# Altium schematic sheet LED.schdoc
size 703 x 248 mm
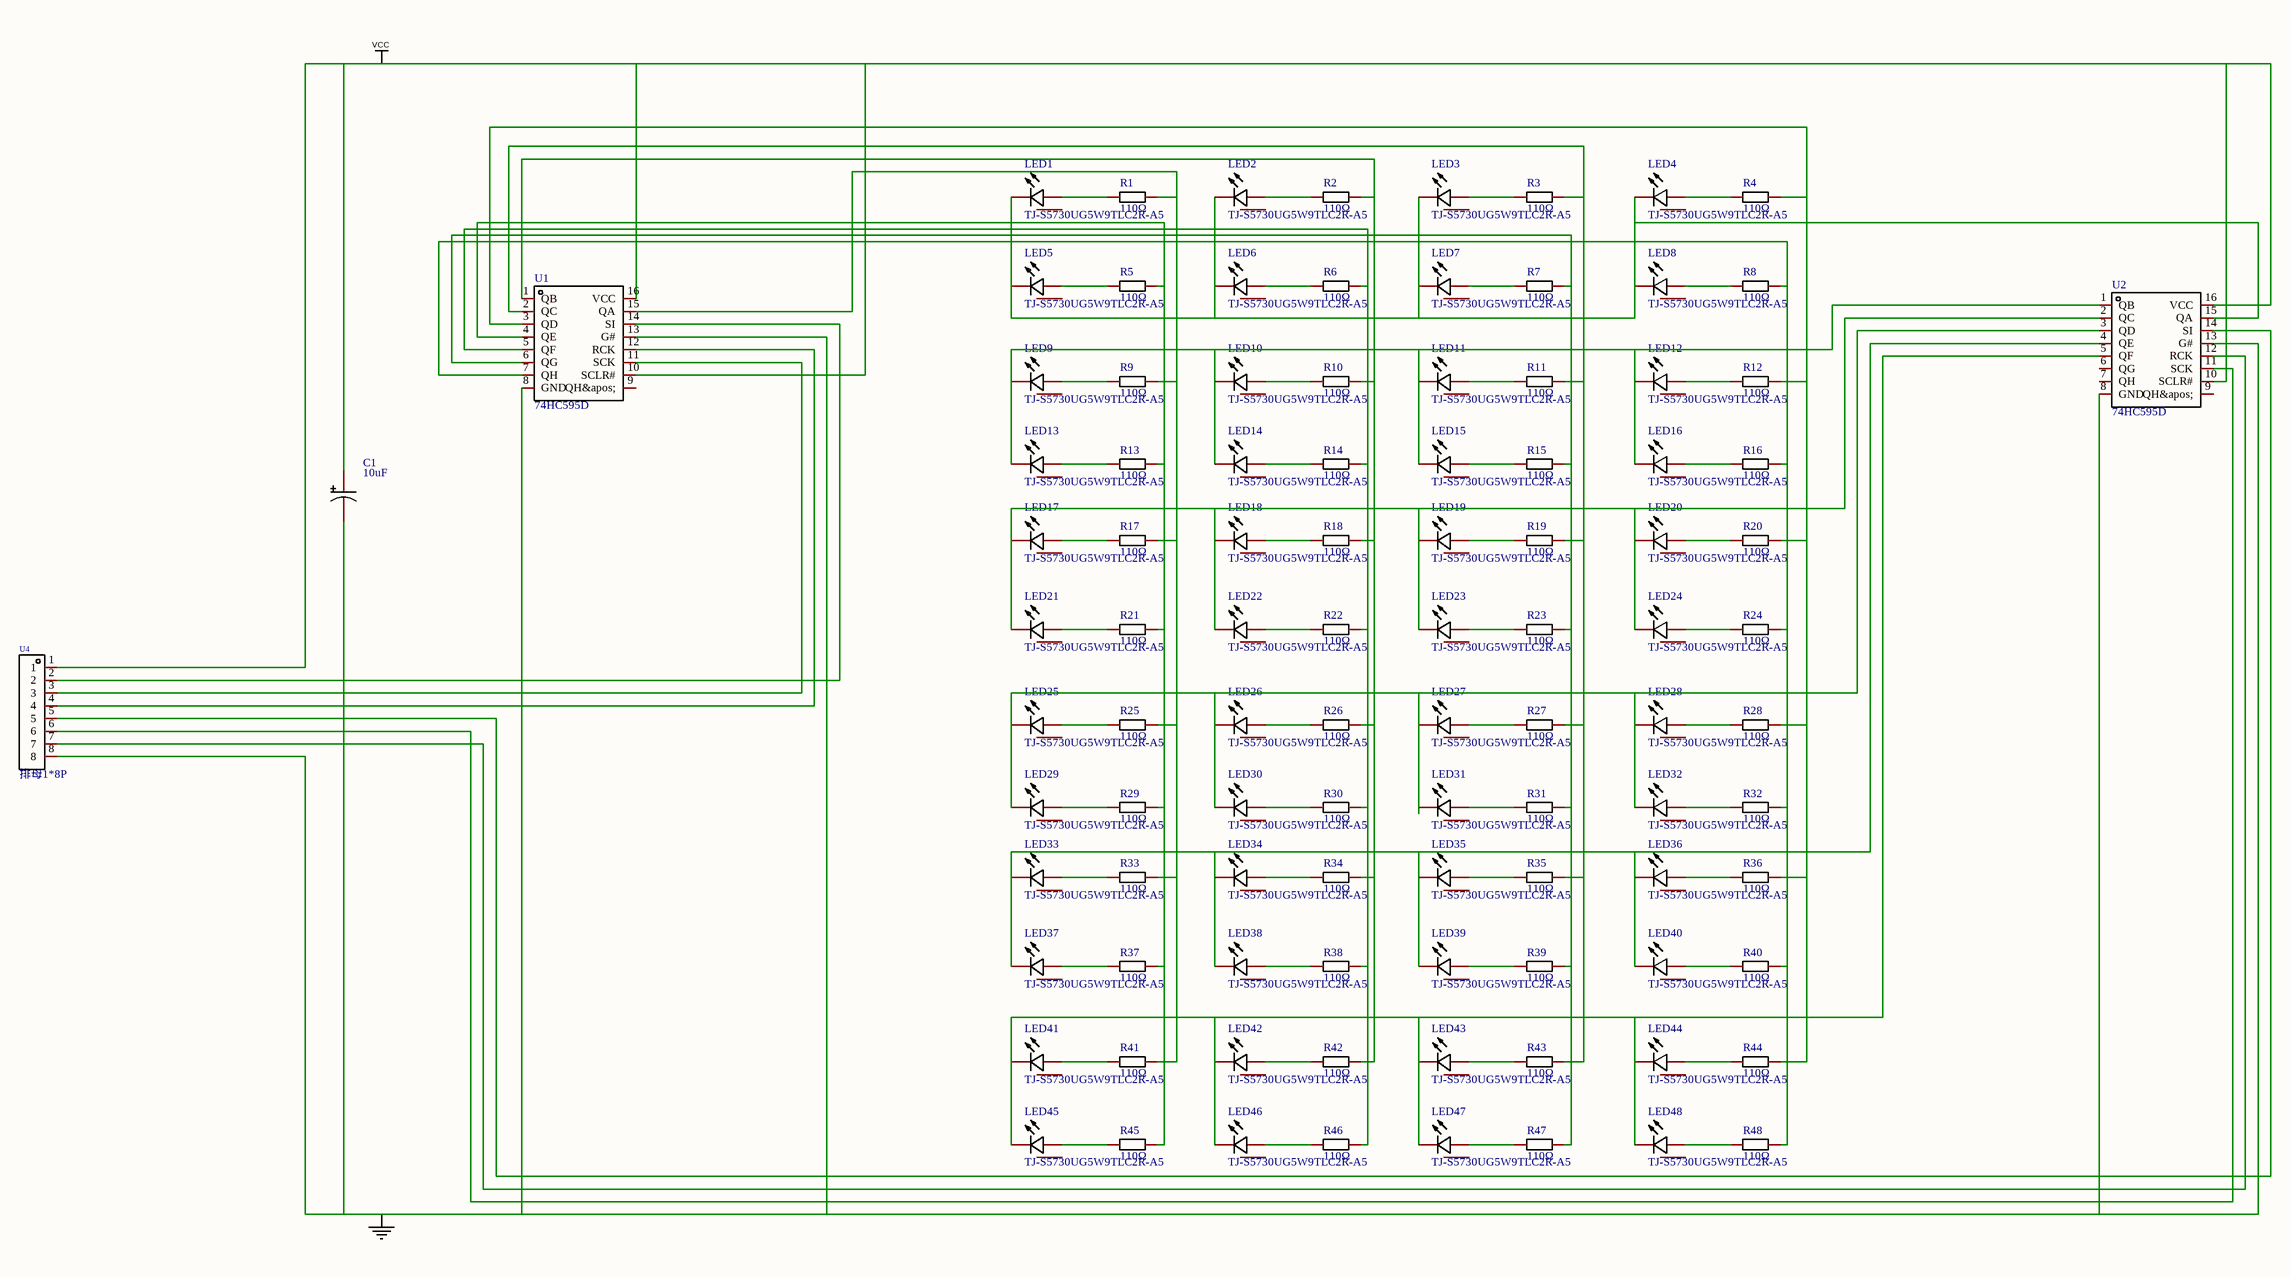
[diagram p0: LED.schdoc]

## Parts
C1  10uF  [CAP-SMD_BD5.0-L5.3-W5.3-LS6.0-FD]
LED1  TJ-S5730UG5W9TLC2R-A5  [LED-SMD_L5.7-W3.0-R-RD]
LED2  TJ-S5730UG5W9TLC2R-A5  [LED-SMD_L5.7-W3.0-R-RD]
LED3  TJ-S5730UG5W9TLC2R-A5  [LED-SMD_L5.7-W3.0-R-RD]
LED4  TJ-S5730UG5W9TLC2R-A5  [LED-SMD_L5.7-W3.0-R-RD]
LED5  TJ-S5730UG5W9TLC2R-A5  [LED-SMD_L5.7-W3.0-R-RD]
LED6  TJ-S5730UG5W9TLC2R-A5  [LED-SMD_L5.7-W3.0-R-RD]
LED7  TJ-S5730UG5W9TLC2R-A5  [LED-SMD_L5.7-W3.0-R-RD]
LED8  TJ-S5730UG5W9TLC2R-A5  [LED-SMD_L5.7-W3.0-R-RD]
LED9  TJ-S5730UG5W9TLC2R-A5  [LED-SMD_L5.7-W3.0-R-RD]
LED10  TJ-S5730UG5W9TLC2R-A5  [LED-SMD_L5.7-W3.0-R-RD]
LED11  TJ-S5730UG5W9TLC2R-A5  [LED-SMD_L5.7-W3.0-R-RD]
LED12  TJ-S5730UG5W9TLC2R-A5  [LED-SMD_L5.7-W3.0-R-RD]
LED13  TJ-S5730UG5W9TLC2R-A5  [LED-SMD_L5.7-W3.0-R-RD]
LED14  TJ-S5730UG5W9TLC2R-A5  [LED-SMD_L5.7-W3.0-R-RD]
LED15  TJ-S5730UG5W9TLC2R-A5  [LED-SMD_L5.7-W3.0-R-RD]
LED16  TJ-S5730UG5W9TLC2R-A5  [LED-SMD_L5.7-W3.0-R-RD]
LED17  TJ-S5730UG5W9TLC2R-A5  [LED-SMD_L5.7-W3.0-R-RD]
LED18  TJ-S5730UG5W9TLC2R-A5  [LED-SMD_L5.7-W3.0-R-RD]
LED19  TJ-S5730UG5W9TLC2R-A5  [LED-SMD_L5.7-W3.0-R-RD]
LED20  TJ-S5730UG5W9TLC2R-A5  [LED-SMD_L5.7-W3.0-R-RD]
LED21  TJ-S5730UG5W9TLC2R-A5  [LED-SMD_L5.7-W3.0-R-RD]
LED22  TJ-S5730UG5W9TLC2R-A5  [LED-SMD_L5.7-W3.0-R-RD]
LED23  TJ-S5730UG5W9TLC2R-A5  [LED-SMD_L5.7-W3.0-R-RD]
LED24  TJ-S5730UG5W9TLC2R-A5  [LED-SMD_L5.7-W3.0-R-RD]
LED25  TJ-S5730UG5W9TLC2R-A5  [LED-SMD_L5.7-W3.0-R-RD]
LED26  TJ-S5730UG5W9TLC2R-A5  [LED-SMD_L5.7-W3.0-R-RD]
LED27  TJ-S5730UG5W9TLC2R-A5  [LED-SMD_L5.7-W3.0-R-RD]
LED28  TJ-S5730UG5W9TLC2R-A5  [LED-SMD_L5.7-W3.0-R-RD]
LED29  TJ-S5730UG5W9TLC2R-A5  [LED-SMD_L5.7-W3.0-R-RD]
LED30  TJ-S5730UG5W9TLC2R-A5  [LED-SMD_L5.7-W3.0-R-RD]
LED31  TJ-S5730UG5W9TLC2R-A5  [LED-SMD_L5.7-W3.0-R-RD]
LED32  TJ-S5730UG5W9TLC2R-A5  [LED-SMD_L5.7-W3.0-R-RD]
LED33  TJ-S5730UG5W9TLC2R-A5  [LED-SMD_L5.7-W3.0-R-RD]
LED34  TJ-S5730UG5W9TLC2R-A5  [LED-SMD_L5.7-W3.0-R-RD]
LED35  TJ-S5730UG5W9TLC2R-A5  [LED-SMD_L5.7-W3.0-R-RD]
LED36  TJ-S5730UG5W9TLC2R-A5  [LED-SMD_L5.7-W3.0-R-RD]
LED37  TJ-S5730UG5W9TLC2R-A5  [LED-SMD_L5.7-W3.0-R-RD]
LED38  TJ-S5730UG5W9TLC2R-A5  [LED-SMD_L5.7-W3.0-R-RD]
LED39  TJ-S5730UG5W9TLC2R-A5  [LED-SMD_L5.7-W3.0-R-RD]
LED40  TJ-S5730UG5W9TLC2R-A5  [LED-SMD_L5.7-W3.0-R-RD]
LED41  TJ-S5730UG5W9TLC2R-A5  [LED-SMD_L5.7-W3.0-R-RD]
LED42  TJ-S5730UG5W9TLC2R-A5  [LED-SMD_L5.7-W3.0-R-RD]
LED43  TJ-S5730UG5W9TLC2R-A5  [LED-SMD_L5.7-W3.0-R-RD]
LED44  TJ-S5730UG5W9TLC2R-A5  [LED-SMD_L5.7-W3.0-R-RD]
LED45  TJ-S5730UG5W9TLC2R-A5  [LED-SMD_L5.7-W3.0-R-RD]
LED46  TJ-S5730UG5W9TLC2R-A5  [LED-SMD_L5.7-W3.0-R-RD]
LED47  TJ-S5730UG5W9TLC2R-A5  [LED-SMD_L5.7-W3.0-R-RD]
LED48  TJ-S5730UG5W9TLC2R-A5  [LED-SMD_L5.7-W3.0-R-RD]
R1  110Ω  [R0603]
R2  110Ω  [R0603]
R3  110Ω  [R0603]
R4  110Ω  [R0603]
R5  110Ω  [R0603]
R6  110Ω  [R0603]
R7  110Ω  [R0603]
R8  110Ω  [R0603]
R9  110Ω  [R0603]
R10  110Ω  [R0603]
R11  110Ω  [R0603]
R12  110Ω  [R0603]
R13  110Ω  [R0603]
R14  110Ω  [R0603]
R15  110Ω  [R0603]
R16  110Ω  [R0603]
R17  110Ω  [R0603]
R18  110Ω  [R0603]
R19  110Ω  [R0603]
R20  110Ω  [R0603]
R21  110Ω  [R0603]
R22  110Ω  [R0603]
R23  110Ω  [R0603]
R24  110Ω  [R0603]
R25  110Ω  [R0603]
R26  110Ω  [R0603]
R27  110Ω  [R0603]
R28  110Ω  [R0603]
R29  110Ω  [R0603]
R30  110Ω  [R0603]
R31  110Ω  [R0603]
R32  110Ω  [R0603]
R33  110Ω  [R0603]
R34  110Ω  [R0603]
R35  110Ω  [R0603]
R36  110Ω  [R0603]
R37  110Ω  [R0603]
R38  110Ω  [R0603]
R39  110Ω  [R0603]
R40  110Ω  [R0603]
R41  110Ω  [R0603]
R42  110Ω  [R0603]
R43  110Ω  [R0603]
R44  110Ω  [R0603]
R45  110Ω  [R0603]
R46  110Ω  [R0603]
R47  110Ω  [R0603]
R48  110Ω  [R0603]
U1  74HC595D  [SOIC-16_L9.9-W3.9-P1.27-LS6.0-BL]
U2  74HC595D  [SOIC-16_L9.9-W3.9-P1.27-LS6.0-BL]
U4  排母1*8P  [HDR-TH_8P-P1.27-V-F]

## Nets
NetC1_2: C1.2 U1.8(GND) U1.13(G#) U2.8(GND) U2.13(G#) U4.8
VCC: C1.1 U1.10(SCLR#) U1.16(VCC) U2.10(SCLR#) U2.16(VCC) U4.1
NetLED1_1: LED1.1(+) R1.1
NetLED1_2: LED1.2(-) LED2.2(-) LED3.2(-) LED4.2(-) LED5.2(-) LED6.2(-) LED7.2(-) LED8.2(-) U2.15(QA)
NetLED2_1: LED2.1(+) R2.1
NetLED3_1: LED3.1(+) R3.1
NetLED4_1: LED4.1(+) R4.1
NetLED5_1: LED5.1(+) R5.1
NetLED6_1: LED6.1(+) R6.1
NetLED7_1: LED7.1(+) R7.1
NetLED8_1: LED8.1(+) R8.1
NetLED9_1: LED9.1(+) R9.1
NetLED9_2: LED9.2(-) LED10.2(-) LED11.2(-) LED12.2(-) LED13.2(-) LED14.2(-) LED15.2(-) LED16.2(-) U2.1(QB)
NetLED10_1: LED10.1(+) R10.1
NetLED11_1: LED11.1(+) R11.1
NetLED12_1: LED12.1(+) R12.1
NetLED13_1: LED13.1(+) R13.1
NetLED14_1: LED14.1(+) R14.1
NetLED15_1: LED15.1(+) R15.1
NetLED16_1: LED16.1(+) R16.1
NetLED17_1: LED17.1(+) R17.1
NetLED17_2: LED17.2(-) LED18.2(-) LED19.2(-) LED20.2(-) LED21.2(-) LED22.2(-) LED23.2(-) LED24.2(-) U2.2(QC)
NetLED18_1: LED18.1(+) R18.1
NetLED19_1: LED19.1(+) R19.1
NetLED20_1: LED20.1(+) R20.1
NetLED21_1: LED21.1(+) R21.1
NetLED22_1: LED22.1(+) R22.1
NetLED23_1: LED23.1(+) R23.1
NetLED24_1: LED24.1(+) R24.1
NetLED25_1: LED25.1(+) R25.1
NetLED25_2: LED25.2(-) LED26.2(-) LED27.2(-) LED28.2(-) LED29.2(-) LED30.2(-) LED31.2(-) LED32.2(-) U2.3(QD)
NetLED26_1: LED26.1(+) R26.1
NetLED27_1: LED27.1(+) R27.1
NetLED28_1: LED28.1(+) R28.1
NetLED29_1: LED29.1(+) R29.1
NetLED30_1: LED30.1(+) R30.1
NetLED31_1: LED31.1(+) R31.1
NetLED32_1: LED32.1(+) R32.1
NetLED33_1: LED33.1(+) R33.1
NetLED33_2: LED33.2(-) LED34.2(-) LED35.2(-) LED36.2(-) LED37.2(-) LED38.2(-) LED39.2(-) LED40.2(-) U2.4(QE)
NetLED34_1: LED34.1(+) R34.1
NetLED35_1: LED35.1(+) R35.1
NetLED36_1: LED36.1(+) R36.1
NetLED37_1: LED37.1(+) R37.1
NetLED38_1: LED38.1(+) R38.1
NetLED39_1: LED39.1(+) R39.1
NetLED40_1: LED40.1(+) R40.1
NetLED41_1: LED41.1(+) R41.1
NetLED41_2: LED41.2(-) LED42.2(-) LED43.2(-) LED44.2(-) LED45.2(-) LED46.2(-) LED47.2(-) LED48.2(-) U2.5(QF)
NetLED42_1: LED42.1(+) R42.1
NetLED43_1: LED43.1(+) R43.1
NetLED44_1: LED44.1(+) R44.1
NetLED45_1: LED45.1(+) R45.1
NetLED46_1: LED46.1(+) R46.1
NetLED47_1: LED47.1(+) R47.1
NetLED48_1: LED48.1(+) R48.1
NetR1_2: R1.2 R9.2 R17.2 R25.2 R33.2 R41.2 U1.15(QA)
NetR2_2: R2.2 R10.2 R18.2 R26.2 R34.2 R42.2 U1.1(QB)
NetR3_2: R3.2 R11.2 R19.2 R27.2 R35.2 R43.2 U1.2(QC)
NetR4_2: R4.2 R12.2 R20.2 R28.2 R36.2 R44.2 U1.3(QD)
NetR5_2: R5.2 R13.2 R21.2 R29.2 R37.2 R45.2 U1.4(QE)
NetR6_2: R6.2 R14.2 R22.2 R30.2 R38.2 R46.2 U1.5(QF)
NetR7_2: R7.2 R15.2 R23.2 R31.2 R39.2 R47.2 U1.6(QG)
NetR8_2: R8.2 R16.2 R24.2 R32.2 R40.2 R48.2 U1.7(QH)
NetU1_11: U1.11(SCK) U4.3
NetU1_12: U1.12(RCK) U4.4
NetU1_14: U1.14(SI) U4.2
NetU2_11: U2.11(SCK) U4.6
NetU2_12: U2.12(RCK) U4.7
NetU2_14: U2.14(SI) U4.5

Not connected (* = marked no-connect by the designer): LED1 3; LED2 3; LED3 3; LED4 3; LED5 3; LED6 3; LED7 3; LED8 3; LED9 3; LED10 3; LED11 3; LED12 3; LED13 3; LED14 3; LED15 3; LED16 3; LED17 3; LED18 3; LED19 3; LED20 3; LED21 3; LED22 3; LED23 3; LED24 3; LED25 3; LED26 3; LED27 3; LED28 3; LED29 3; LED30 3; LED31 3; LED32 3; LED33 3; LED34 3; LED35 3; LED36 3; LED37 3; LED38 3; LED39 3; LED40 3; LED41 3; LED42 3; LED43 3; LED44 3; LED45 3; LED46 3; LED47 3; LED48 3; U1 9(QH&apos;); U2 6(QG) 7(QH) 9(QH&apos;)

## Library data of the parts
C1 = EEEFK1H100UR: 容值:10uF;精度:±20%;额定电压:50V;纹波电流:63.75mA@120Hz;等效串联电阻:-;; Manufacturer: PANASONIC(松下); Add into BOM: yes; Tolerance: ±20%; Rated Voltage: 50V; φD: 5mm; L: 6.1mm; Lifetime @ Temp: 2000hrs@105℃; Name: 10uF; Symbol: EEEFK1H100UR; Device: EEEFK1H100UR; LCSC Part Name: 10uF ±20% 50V; Supplier Part: C178547; Manufacturer Part: EEEFK1H100UR; Supplier Footprint: -; JLCPCB Part Class: 扩展库; Datasheet: https://atta.szlcsc.com/upload/public/pdf/source/20180621/C178547_53A74A8EA43201A2B9EF4706D6EA1CAA.pdf; Supplier: LCSC; Convert to PCB: yes; Value: 10uF; Ripple Current: 63.75mA@120Hz; Equivalent Series Resistance(ESR): -; Operating Temperature: -45℃~+105℃
LED1-LED48 = TJ-S5730UG5W9TLC2R-A5: 发光颜色:红灯;二极管配置:-;主波长:620nm~630nm;色温:-;功率:390mW;安装方式:-;; Manufacturer: TOGIALED(统佳); Add into BOM: yes; Emitted Color: 红灯; Peak Wavelength: 615nm; Forward Current: 150mA; Power Dissipation: 390mW; Viewing Angle: 120°; Name: TJ-S5730UG5W9TLC2R-A5; Symbol: TJ-S5730UG5W9TLC2R-A5; Device: TJ-S5730UG5W9TLC2R-A5; LCSC Part Name: 红灯; Supplier Part: C440453; Manufacturer Part: TJ-S5730UG5W9TLC2R-A5; Supplier Footprint: SMD5730; JLCPCB Part Class: 扩展库; Datasheet: https://atta.szlcsc.com/upload/public/pdf/source/20191029/C440453_24F32ECFD35DBED6884957690370B850.pdf; Supplier: LCSC; Convert to PCB: yes; Diode Configuration: -; Lens Color: -; Dominant Wavelength: 620nm~630nm; Color Temperature: -; Mounting Sytle: -; Operating Temperature: -40℃~+80℃
R1-R48 = 0603WAF1100T5E: 电阻类型:厚膜电阻;阻值:110Ω;精度:±1%;功率:100mW;; Manufacturer: UNI-ROYAL(厚声); Add into BOM: yes; Tolerance: ±1%; Power(Watts): 100mW; Temperature Coefficient: ±100ppm/℃; Overload Voltage (Max): 75V; Name: 110Ω; Symbol: 0603WAF1100T5E; Device: 0603WAF1100T5E; LCSC Part Name: 110Ω ±1% 100mW; Supplier Part: C22781; Manufacturer Part: 0603WAF1100T5E; Supplier Footprint: 0603; JLCPCB Part Class: 扩展库; Datasheet: https://atta.szlcsc.com/upload/public/pdf/source/20200306/C422600_1E6D84923E4A46A82E41ADD87F860B5C.pdf; Supplier: LCSC; Convert to PCB: yes; Type: 厚膜电阻; Value: 110Ω; Operating Temperature Range: -55℃~+155℃
U1 U2 = 74HC595D_C431479: 功能:串行至串行或并行;电源电压:2V~6V;; Manufacturer: TOSHIBA(东芝); Add into BOM: yes; Output Type: 三态; Supply Voltage: 2V~6V; Name: 74HC595D; Symbol: 74HC595D_C431479; Device: 74HC595D_C431479; LCSC Part Name: 三态输出 串行至串行或并行移位寄存器; Supplier Part: C431479; Manufacturer Part: 74HC595D; Supplier Footprint: SOIC-16; JLCPCB Part Class: 扩展库; Datasheet: https://atta.szlcsc.com/upload/public/pdf/source/20190920/C431479_35AD716FF5894FB7E9B0D7A2C001D0DE.pdf; Supplier: LCSC; Convert to PCB: yes; Series: -; Function: 串行至串行或并行; Operating Temperature: -40℃~+125℃
U4 = 排母1*8P: 排数:单排;总孔位数:8;间距:1.27mm;行距:-;安装类型:直插;塑高:-;触头材质:-;触头镀层:-;; Manufacturer: BOOMELE(博穆精密); Add into BOM: yes; Number of Holes: 8; Pitch: 1.27mm; Name: 排母1*8P; Symbol: 排母1*8P; Device: 排母1*8P; LCSC Part Name: 1.27mm; Supplier Part: C92297; Manufacturer Part: 排母1*8P; Supplier Footprint: 直插,P=1.27mm; JLCPCB Part Class: Extended Part; Supplier: LCSC; Convert to PCB: yes; Number of Rows: 单排; Row Spacing: -; Mounting Type: 直插; Insulation Height: -; Contact Material: -; Contact Plating: -